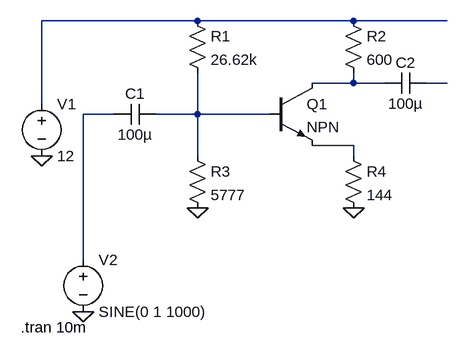
[diagram p0: schematic aux_preamp.asc]
aux_preamp.asc, the LTspice schematic file:
Version 4
SHEET 1 880 680
WIRE 192 0 -48 0
WIRE 432 0 192 0
WIRE 576 0 432 0
WIRE 432 96 432 80
WIRE 432 96 368 96
WIRE 480 96 432 96
WIRE 576 96 544 96
WIRE -48 128 -48 0
WIRE 64 144 16 144
WIRE 192 144 192 80
WIRE 192 144 128 144
WIRE 304 144 192 144
WIRE 432 192 368 192
WIRE 192 208 192 144
WIRE 432 208 432 192
WIRE 16 368 16 144
FLAG -48 208 0
FLAG 432 288 0
FLAG 192 288 0
FLAG 16 448 0
SYMBOL voltage -48 112 R0
WINDOW 123 0 0 Left 0
WINDOW 39 0 0 Left 0
SYMATTR InstName V1
SYMATTR Value 12
SYMBOL res 176 -16 R0
SYMATTR InstName R1
SYMATTR Value 26.62k
SYMBOL res 416 -16 R0
SYMATTR InstName R2
SYMATTR Value 600
SYMBOL res 176 192 R0
SYMATTR InstName R3
SYMATTR Value 5777
SYMBOL res 416 192 R0
SYMATTR InstName R4
SYMATTR Value 144
SYMBOL npn 304 96 R0
SYMATTR InstName Q1
SYMBOL voltage 16 352 R0
WINDOW 123 0 0 Left 0
WINDOW 39 0 0 Left 0
SYMATTR InstName V2
SYMATTR Value SINE(0 1 1000)
SYMBOL cap 128 128 R90
WINDOW 0 0 32 VBottom 2
WINDOW 3 32 32 VTop 2
SYMATTR InstName C1
SYMATTR Value 100µ
SYMBOL cap 544 80 R90
WINDOW 0 0 32 VBottom 2
WINDOW 3 32 32 VTop 2
SYMATTR InstName C2
SYMATTR Value 100µ
TEXT -80 472 Left 2 !.tran 10m

The netlist it stands for:
* aux_preamp.asc
V1 N001 0 12
R1 N001 N005 26.62k
R2 N001 N002 600
R3 N005 0 5777
R4 N006 0 144
Q1 N002 N005 N006 0 NPN
V2 N004 0 SINE(0 1 1000)
C1 N005 N004 100µ
C2 N003 N002 100µ
.model NPN NPN
.model PNP PNP
.lib standard.bjt
.tran 10m
.backanno
.end